# EasyEDA Pro project ProProject_MagicBerry_2.1.epro, board PCB_2.1
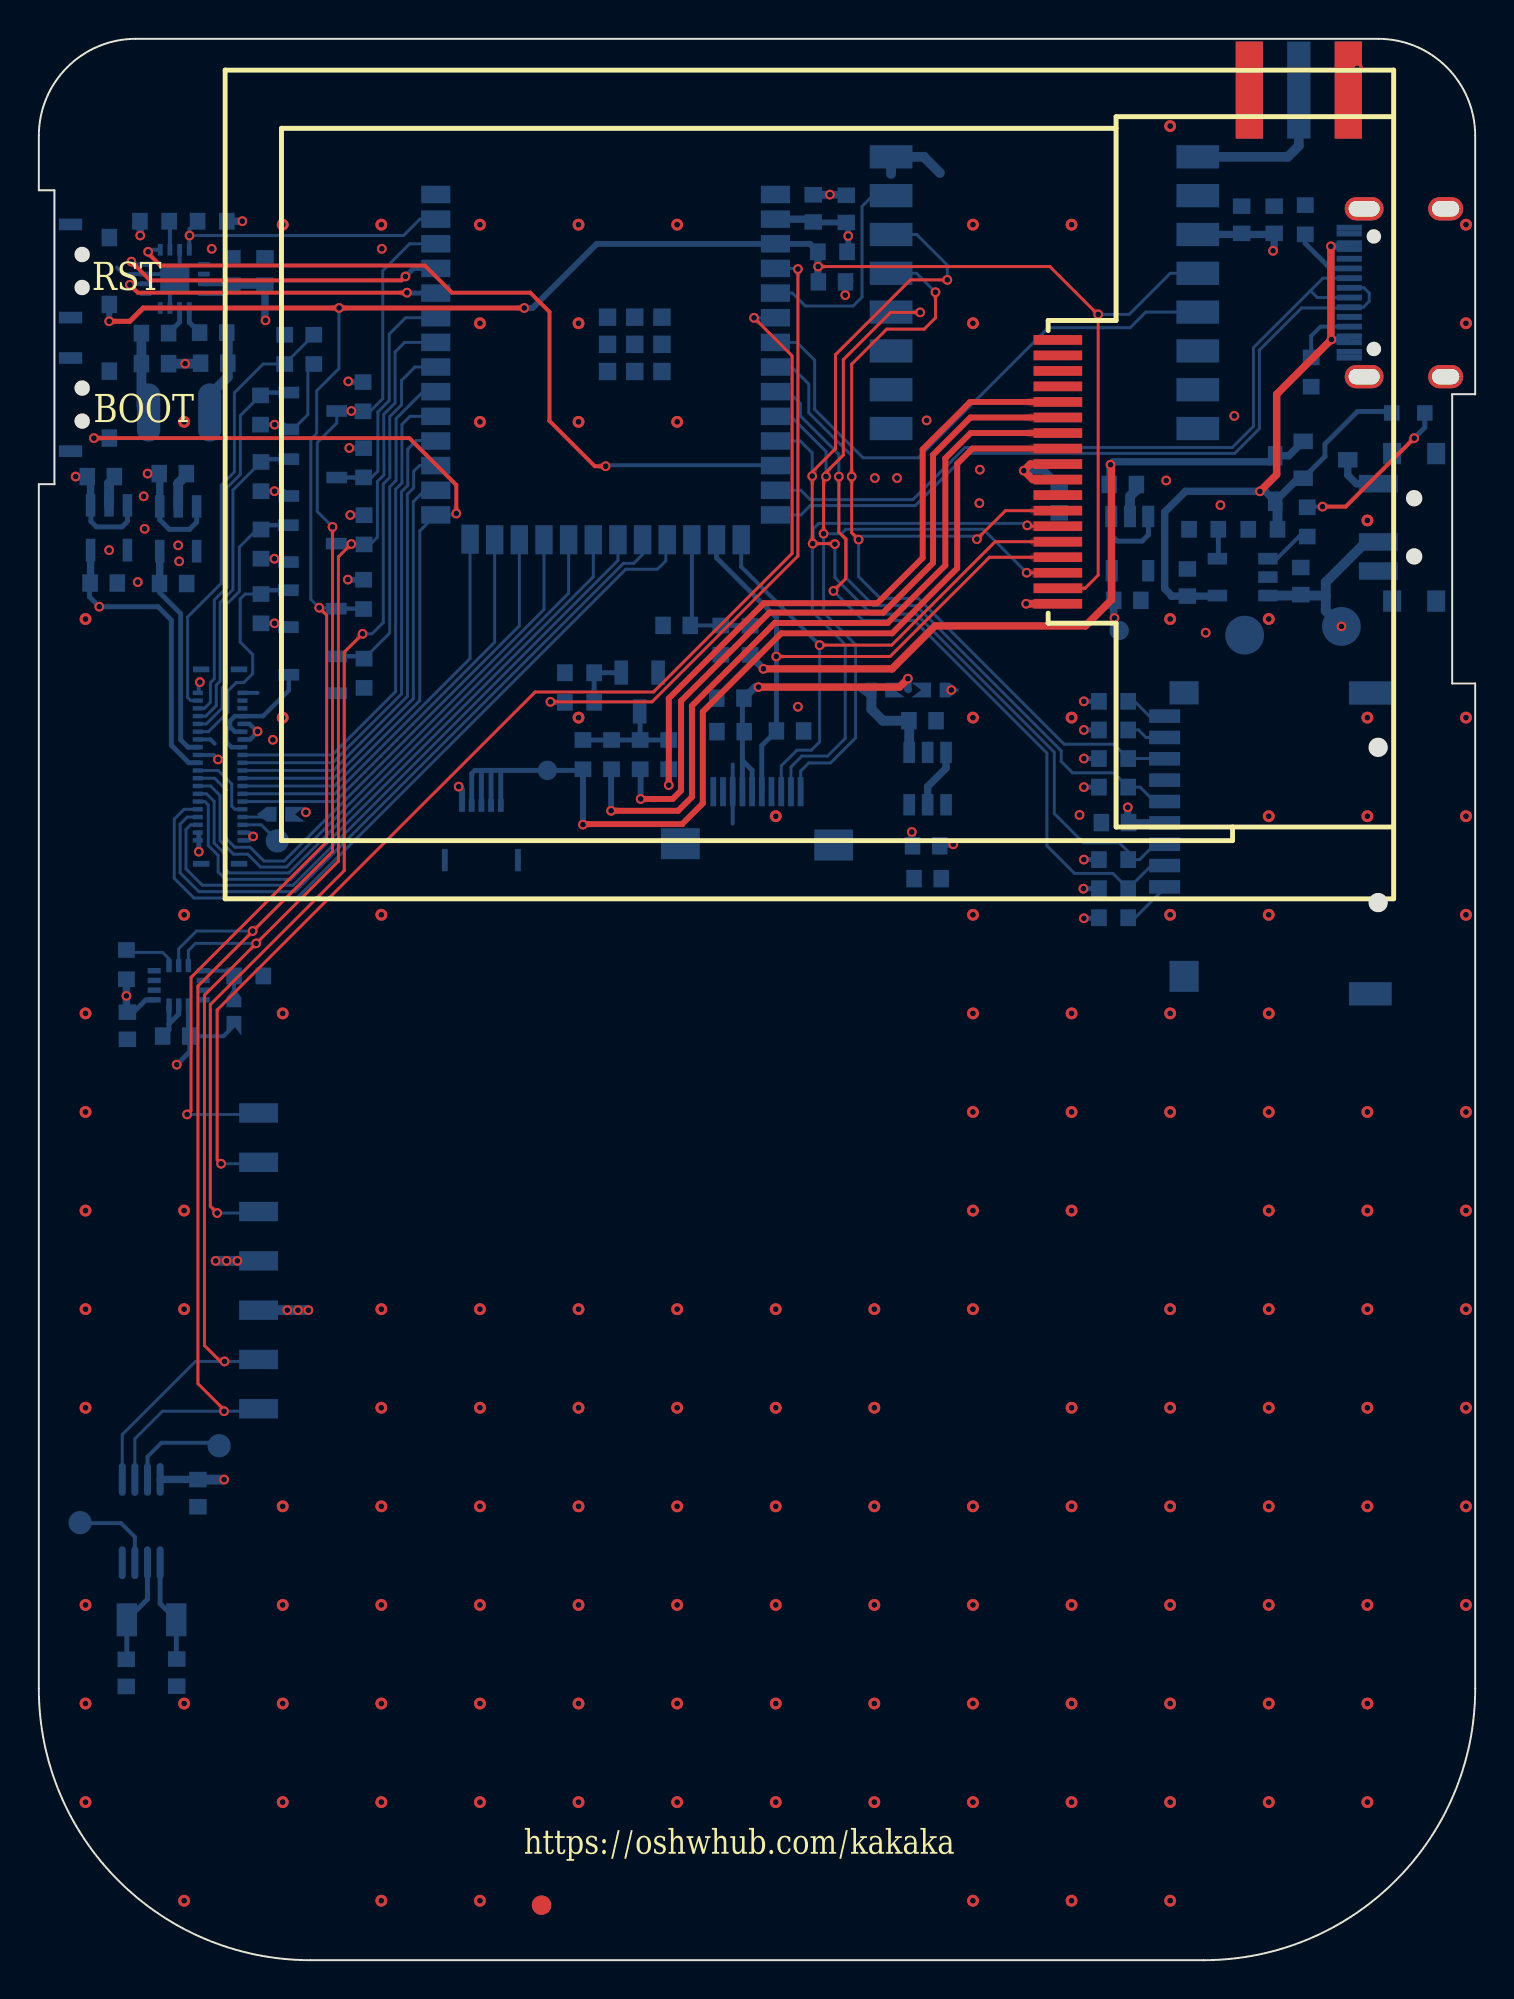
[diagram p9: board, top side]
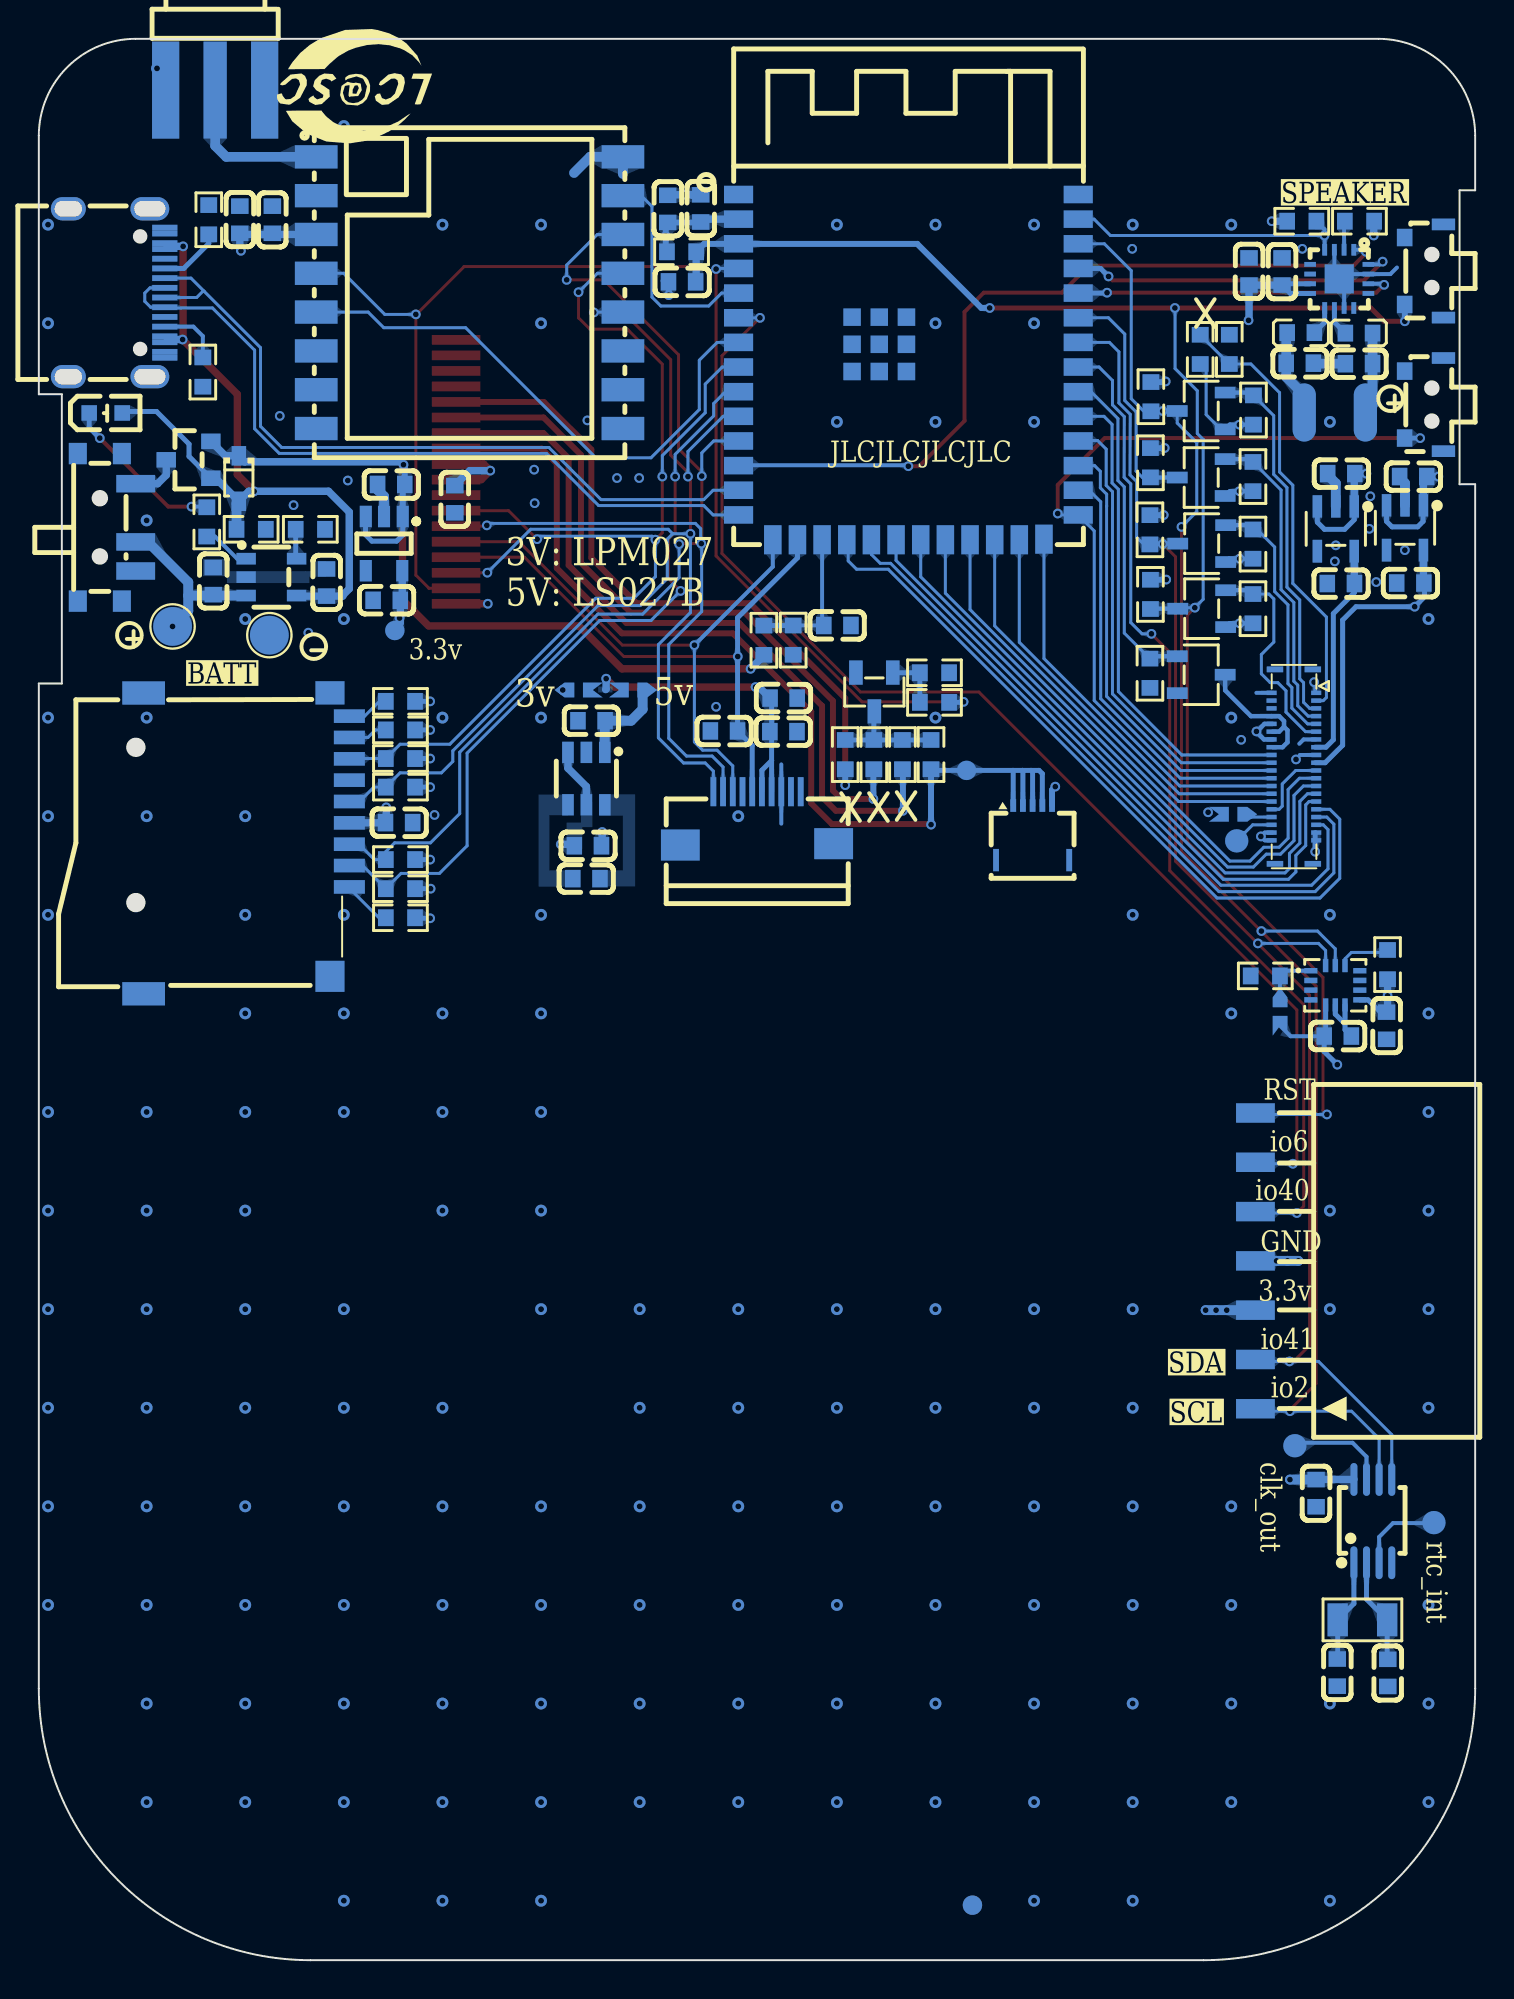
[diagram p10: board, bottom side, seen from below]

Outline 74 x 99 mm; copper layers: Top Layer, PWR, GND, Bottom Layer. Coordinates in mm from the lower left corner of the outline.
Outline path: 0,94 0,91.19 0.81,91.19 0.81,76.05 0,76.05 0,14 arc(4.1,4.1) 14,0 60,0 arc(69.9,4.1) 74,14 74,65.78 72.81,65.78 72.81,80.69 74,80.69 74,94 arc(72.54,97.54) 69,99 5,99 arc(1.46,97.54) 0,94
Stack: Top Layer 0.035mm / Dielectric1 0.48mm PP er 4.5 / PWR 0.035mm / Dielectric2 0.48mm FR4 er 4.5 / GND 0.035mm / Dielectric3 0.48mm PP er 4.5 / Bottom Layer 0.035mm

## Design rules (mm)
net IO20: DP1
net IO19: DP1
template: 用户自定义配置
spacing safeClearance (default): track to track 0.15, other pairs 0.152 to 0.3
track width trackWidth (default): min 0.127, default 0.254, max 2.54
differential pair differentialPair (default): width min 0.127, default 0.254, max 2.54; gap min 0.152, default 0.152
via viaSize (default): diameter min 0.5, default 0.61, max 10; hole min 0.3, default 0.305, max 5.999
net 3.3V uses copperRegion1

## Placement (name value [footprint] x y rotation side)
C2  10uF  [C0603]  55.85 76.04 0 bottom
C5  10uF  [C0603]  56.08 70.07 180 bottom
C8  1uF  [C0603]  3.19 76.44 0 bottom
C10  10uF  [C0603]  65.02 71.06 270 bottom
C11  10uF  [C0603]  59.17 70.98 270 bottom
C16  100nF  [C0603]  38.7 63.34 0 bottom
C17  1uF  [C0603]  35.64 63.3 180 bottom
C18  100nF  [C0603]  35.63 65.03 180 bottom
C27  100nF  [C0603]  55.44 58.61 0 bottom
C31  10uF  [C0603]  41.6 90.24 270 bottom
C32  100nF  [C0603]  39.9 90.26 90 bottom
C33  1uF  [C0603]  40.86 86.48 0 bottom
C34  10uF  [C0603]  11.65 87.01 270 bottom
C35  100nF  [C0603]  9.95 87.01 90 bottom
C36  10uF  [C0603]  45.71 57.42 0 bottom
C37  10uF  [C0603]  45.52 63.86 180 bottom
C38  2.2uF  [C0603]  45.79 55.73 180 bottom
C39  1uF  [C0603]  6.92 70.93 0 bottom
C40  1uF  [C0603]  3.34 70.96 0 bottom
C41  1uF  [C0603]  6.9 76.6 0 bottom
C42  100nF  [C0603]  32.86 68.77 180 bottom
C43  10uF  [C0603]  52.57 75.28 90 bottom
C44  10uF  [C0603]  63.64 89.68 270 bottom
C45  100nF  [C0603]  61.97 89.68 90 bottom
C47  680pF  [C0603]  9.03 82.29 0 bottom
C48  680pF  [C0603]  5.99 82.26 0 bottom
C49  6pF  [C0603]  4.5 14.8 90 bottom
C50  6pF  [C0603]  7.1 14.82 270 bottom
C51  10uF  [C0603]  8.2 24.06 90 bottom
C52  100nF  [C0603]  7.08 47.62 180 bottom
C53  100nF  [C0603]  4.56 48.15 270 bottom
CARD1  TF-01A  [TF-SMD_TF-02]  63.3 57.55 270 bottom
D4  1N5819WS  [SOD-323_L1.8-W1.3-LS2.5-RD]  63.7 76.34 270 bottom
FPC1  AFC01-S10FCC-00  [FPC-SMD_AFC01-S10FCC-00]  37 58.83 180 bottom
FPC2  0.5K-QX-5PWB  [FPC-SMD_5P-P0.50_HDGC_0.5K-QX-5PWB]  22.8 58.09 180 bottom
J1  2短路点  [短路接口]  12.57 59.05 0 bottom
J2  2短路点  [短路接口]  43.48 65.45 0 bottom
J3  2短路点  [短路接口]  46.09 65.45 180 bottom
J4  2短路点  [短路接口]  10.05 48.78 270 bottom
L3  BLM18SG331TN1D  [L0603]  5.99 83.84 180 bottom
L4  BLM18SG331TN1D  [L0603]  8.98 83.86 0 bottom
LED5  -  [LED0603-R-RD]  70.55 79.72 180 bottom
NOREF  -  [Pad_e339]  5.66 79.75 0 top
NOREF#2  -  [Pad_e323]  9.29 26.51 0 top
NOREF#3  -  [Pad_e2492]  25.9 2.84 0 top
NOREF#4  -  [Pad_e348]  2.13 22.55 0 top
NOREF#5  -  [Pad_e340]  8.81 79.75 0 top
NOREF#6  -  [Pad_e2940]  12.29 57.67 0 top
NOREF#7  -  [Pad_e2494]  25.9 2.84 0 top
P1  HDR-PAD_2.54  [PAD1_SMD_1.2]  55.66 68.51 180 bottom
P2  HDR-PAD_2.54  [PAD1_SMD_1.2]  26.2 61.31 0 bottom
Q1  BSS138  [SOT-23-3_L2.9-W1.6-P1.90-LS2.8-BR]  14.11 66.23 0 bottom
Q3  BSS138  [SOT-23-3_L2.9-W1.6-P1.90-LS2.8-BR]  14.11 79.82 180 bottom
Q4  BSS138  [SOT-23-3_L2.9-W1.6-P1.90-LS2.8-BR]  14.09 72.99 180 bottom
Q5  BSS138  [SOT-23-3_L2.9-W1.6-P1.90-LS2.8-BR]  14.11 76.39 180 bottom
Q6  BSS138  [SOT-23-3_L2.9-W1.6-P1.90-LS2.8-BR]  14.09 69.64 180 bottom
Q7  AO3401A  [SOT-23_L2.9-W1.3-P1.90-LS2.4-BR]  66.29 77.31 180 bottom
Q10  -  [SOT-23-3_L2.9-W1.3-P1.90-LS2.4-BR]  30.95 65.34 90 bottom
R1  10kΩ  [R0603]  16.76 66.31 90 bottom
R3  5.1kΩ  [R0603]  65.24 89.68 90 bottom
R6  5.1kΩ  [R0603]  65.55 81.83 270 bottom
R10  10kΩ  [R0603]  14.17 83 270 bottom
R12  10kΩ  [R0603]  11.42 79.87 270 bottom
R13  10kΩ  [R0603]  16.71 80.56 90 bottom
R14  10kΩ  [R0603]  11.45 72.97 270 bottom
R15  10kΩ  [R0603]  16.76 73.7 90 bottom
R16  10kΩ  [R0603]  11.45 76.44 270 bottom
R17  10kΩ  [R0603]  16.73 77.16 90 bottom
R18  10kΩ  [R0603]  11.45 69.64 270 bottom
R19  10kΩ  [R0603]  16.73 70.37 90 bottom
R28  10kΩ  [R0603]  55.37 55.21 180 bottom
R29  10kΩ  [R0603]  55.37 56.71 180 bottom
R30  10kΩ  [R0603]  55.37 60.44 180 bottom
R31  10kΩ  [R0603]  55.37 61.92 180 bottom
R32  10kΩ  [R0603]  55.37 64.86 180 bottom
R33  10kΩ  [R0603]  40.89 88.03 0 bottom
R34  10kΩ  [R0603]  55.37 53.71 180 bottom
R35  10kΩ  [R0603]  55.37 63.39 180 bottom
R36  100kΩ  [R0603]  63.06 73.73 0 bottom
R39  1kΩ  [R0603]  65.35 74.11 90 bottom
R41  1.65kΩ  [R0603]  60.01 73.73 0 bottom
R42  634kΩ  [R0603]  8.93 89.6 0 bottom
R43  100kΩ  [R0603]  5.96 89.6 180 bottom
R44  10kΩ  [R0603]  27.86 66.34 0 bottom
R45  1kΩ  [R0603]  27.86 64.81 0 bottom
R46  20Ω  [R0603]  28.03 62.12 270 bottom
R47  20Ω  [R0603]  29.51 62.12 270 bottom
R48  20Ω  [R0603]  30.98 62.12 270 bottom
R49  20Ω  [R0603]  32.45 62.12 270 bottom
R50  100kΩ  [R0603]  35.13 68.02 90 bottom
R51  200kΩ  [R0603]  36.64 68.01 270 bottom
R53  10kΩ  [R0603]  12.67 83 270 bottom
R54  10kΩ  [R0603]  4.51 51.3 270 bottom
R55  10kΩ  [R0603]  10.81 50.71 0 bottom
RF1  KH-SMA-KE8-G  [CONN-SMD_KH-SMA-KE8-G]  64.91 96.36 180 bottom
SW8  TD-1100SA-250  [SW-SMD_TD-1100SA-250]  2.63 80.15 270 bottom
SW9  TD-1100SA-250  [SW-SMD_TD-1100SA-250]  2.63 87.04 270 bottom
SW11  MK-12C02-G020  [SW-SMD_MK-12C02-G020]  70.5 73.83 270 bottom
TP3  TestPoint  [TestPoint:TestPoint_Pad_D1.0mm]  67.11 68.72 0 bottom
TP4  TestPoint  [TestPoint:TestPoint_Pad_D1.0mm]  62.12 68.27 0 bottom
U1  BBQ20KBD  [Connector_Hirose_Extra:BM20B(0.8)-40DS-0.4V]  9.34 61.5 270 bottom
U3  X6511FRS-07-C85D30  [HDR-SMD_7P-P2.54-H-F-L11.5]  11.32 36.03 90 bottom
U4  ME6212C18M5G  [SOT-23-5_L3.0-W1.7-P0.95-LS2.8-BL]  3.62 73.81 0 bottom
U5  ME6212C28M5G  [SOT-23-5_L3.0-W1.7-P0.95-LS2.8-BL]  7.18 73.75 0 bottom
U6  AP2112K-3.3TRG1  [SOT-25-5_L3.0-W1.8-P0.95-LS3.0-BR]  56.2 72.99 90 bottom
U14  ESP32-S3-WROOM-1-N8R2  [WIRELM-SMD_ESP32-S3-WROOM-1]  29.2 82.08 180 bottom
U15  MAX98357AETE+T  [TQFN-16_L3.0-W3.0-P0.50-BL-EP1.5]  7 86.63 0 bottom
U16  Ra-01S  [COMM-SMD_RA-01S]  51.81 85.92 180 bottom
U18  -  [SOT-23-5_L3.0-W1.7-P0.95-LS2.8-BR]  62.02 71.26 0 bottom
U19  ILI9341_2.4寸_SPI_18PIN  [ILI9341_2.4寸_240X320_SPI_18PIN]  37 76.04 90 top
U20  HX4002-MFC  [SOT-23-6_L2.9-W1.6-P0.95-LS2.8-BR]  45.79 60.88 90 bottom
U25  BM8563EMA  [MSOP-8_L3.0-W3.0-P0.65-LS5.0-BL]  5.27 22.62 180 bottom
U26  LSM6DS3TR-C  [LGA-14_L3.0-W2.5-P0.50-TL]  7.21 50.23 180 bottom
USBC1  TYPE-C-31-M-12  [USB-C_SMD-TYPE-C-31-M-12]  69.99 85.92 270 bottom
X3  32.768kHz  [OSC-SMD_L3.2-W1.5]  5.81 17.54 0 bottom

## Footprints (pads in the part's own frame, mm; a bottom-side part is the same pattern mirrored in y, then rotated)
C0603
  rect 0.8x0.9 smd: 1(-0.7,0) 2(0.7,0)
COMM-SMD_RA-01S
  rect 2.2x1.2 smd: 1(-7.9,7) 2(-7.9,5) 3(-7.9,3) 4(-7.9,1) 5(-7.9,-1) 6(-7.9,-3) 7(-7.9,-5) 8(-7.9,-7) 9(7.9,-7) 10(7.9,-5) 11(7.9,-3) 12(7.9,-1) 13(7.9,1) 14(7.9,3) 15(7.9,5) 16(7.9,7)
CONN-SMD_KH-SMA-KE8-G
  rect 1.4x5 smd: 1(-2.55,0) 2(2.55,0)
  rect 1.4x5 smd far side: 3(-2.55,0) 4(2.55,0)
  rect 1.2x5 smd: 5(0,0)
Connector_Hirose_Extra:BM20B(0.8)-40DS-0.4V
  rect 0.23x0.52 smd: 1(-3.8,1.15) 2(-3.4,1.15) 3(-3,1.15) 4(-2.6,1.15) 5(-2.2,1.15) 6(-1.8,1.15) 7(-1.4,1.15) 8(-1,1.15) 9(-0.6,1.15) 10(-0.2,1.15) 11(0.2,1.15) 12(0.6,1.15) 13(1,1.15) 14(1.4,1.15) 15(1.8,1.15) 16(2.2,1.15) 17(2.6,1.15) 18(3,1.15) 19(3.4,1.15) 20(3.8,1.15) 21(3.8,-1.15) 22(3.4,-1.15) 23(3,-1.15) 24(2.6,-1.15) 25(2.2,-1.15) 26(1.8,-1.15) 27(1.4,-1.15) 28(1,-1.15) 29(0.6,-1.15) 30(0.2,-1.15) 31(-0.2,-1.15) 32(-0.6,-1.15) 33(-1,-1.15) 34(-1.4,-1.15) 35(-1.8,-1.15) 36(-2.2,-1.15) 37(-2.6,-1.15) 38(-3,-1.15) 39(-3.4,-1.15) 40(-3.8,-1.15)
  rect 0.3x0.85 smd: 41(-5.01,0.975) 42(-5.01,-0.975) 43(5.01,0.975) 44(5.01,-0.975)
FPC-SMD_5P-P0.50_HDGC_0.5K-QX-5PWB
  rect 0.3x0.65 smd: 1(-1,1.405) 2(-0.5,1.405) 3(0,1.405) 4(0.5,1.405) 5(1,1.405)
  rect 0.3x1.15 smd: 6(1.885,-1.405) 7(-1.885,-1.405)
FPC-SMD_AFC01-S10FCC-00
  rect 0.3x1.5 smd: 1(-2.248,1.373) 2(-1.748,1.373) 3(-1.248,1.373) 4(-0.748,1.373) 5(-0.247,1.373) 6(0.253,1.373) 7(0.753,1.373) 8(1.252,1.373) 9(1.752,1.373) 10(2.252,1.373)
  rect 2x1.6 smd: 11(-3.95,-1.373) 12(3.95,-1.305)
HDR-SMD_7P-P2.54-H-F-L11.5
  rect 1x2 smd: 1(-7.62,0) 2(-5.08,0) 3(-2.54,0) 4(0,0) 5(2.54,0) 6(5.08,0) 7(7.62,0)
ILI9341_2.4寸_240X320_SPI_18PIN
  rect 0.5x2.5 smd: 1(-6.15,-15.5) 2(-5.35,-15.5) 3(-4.55,-15.5) 4(-3.75,-15.5) 5(-2.95,-15.5) 6(-2.15,-15.5) 7(-1.35,-15.5) 8(-0.55,-15.5) 9(0.25,-15.5) 10(1.05,-15.5) 11(1.85,-15.5) 12(2.65,-15.5) 13(3.45,-15.5) 14(4.25,-15.5) 15(5.05,-15.5) 16(5.85,-15.5) 17(6.65,-15.5) 18(7.45,-15.5)
L0603
  rect 0.8x0.864 smd: 1(-0.7,0) 2(0.7,0)
LED0603-R-RD
  rect 0.8x0.8 smd: 1(0.851,0) 2(-0.851,0)
LGA-14_L3.0-W2.5-P0.50-TL
  rect 0.675x0.28 smd: 1(-1.262,0.75) 2(-1.262,0.25) 3(-1.262,-0.25) 4(-1.262,-0.75) 8(1.262,-0.75) 9(1.262,-0.25) 10(1.262,0.25) 11(1.262,0.75)
  rect 0.28x0.675 smd: 5(-0.5,-1.012) 6(0,-1.012) 7(0.5,-1.012) 12(0.5,1.012) 13(0,1.012) 14(-0.5,1.012)
MSOP-8_L3.0-W3.0-P0.65-LS5.0-BL
  oval 0.364x1.692 smd: 1(-0.975,-2.146) 2(-0.325,-2.146) 3(0.325,-2.146) 4(0.975,-2.146) 5(0.975,2.146) 6(0.325,2.146) 7(-0.325,2.146) 8(-0.975,2.146)
OSC-SMD_L3.2-W1.5
  rect 1.05x1.7 smd: 1(-1.275,0) 2(1.275,0)
PAD1_SMD_1.2
  round 1 smd: 1(0,0)
Pad_e323
  round 1.2 smd far side: 1(0,0)
Pad_e339
  oval 1.2x3 smd far side: 1(0,0)
Pad_e340
  oval 1.2x3 smd far side: 2(0,0)
Pad_e348
  round 1.2 smd far side: 1(0,0)
Pad_e2492
  round 1 smd: 1(0,0)
Pad_e2494
  round 1 smd far side: 1(0,0)
Pad_e2940
  round 1.2 smd far side: 1(0,0)
R0603
  rect 0.806x0.864 smd: 1(-0.753,0) 2(0.753,0)
SOD-323_L1.8-W1.3-LS2.5-RD
  rect 1x0.75 smd: 1(-1.173,0) 2(1.173,0)
SOT-23-3_L2.9-W1.3-P1.90-LS2.4-BR
  rect 1.25x0.7 smd: 1(1,-0.95) 2(1,0.95) 3(-1,0)
SOT-23-3_L2.9-W1.6-P1.90-LS2.8-BR
  rect 1.07x0.6 smd: 1(1.235,-0.95) 2(1.235,0.95) 3(-1.235,0)
SOT-23-5_L3.0-W1.7-P0.95-LS2.8-BL
  rect 0.49x1.157 smd: 1(-0.95,-1.153) 2(0,-1.153) 3(0.95,-1.153)
  rect 0.49x1.175 smd: 4(0.95,1.153) 5(-0.95,1.153)
SOT-23-5_L3.0-W1.7-P0.95-LS2.8-BR
  rect 1.001x0.6 smd: 1(1.3,-0.95) 2(1.3,0) 3(1.3,0.95) 4(-1.3,0.95) 5(-1.3,-0.95)
SOT-23-6_L2.9-W1.6-P0.95-LS2.8-BR
  rect 1.1x0.6 smd: 1(1.35,-0.95) 2(1.35,0) 3(1.35,0.95) 4(-1.35,0.95) 5(-1.35,0) 6(-1.35,-0.95)
SOT-23_L2.9-W1.3-P1.90-LS2.4-BR
  rect 1x0.8 smd: 1(1.15,-0.95) 2(1.15,0.95) 3(-1.15,0)
SOT-25-5_L3.0-W1.8-P0.95-LS3.0-BR
  rect 1.105x0.623 smd: 1(1.397,-0.953) 2(1.397,0.013) 3(1.397,0.953) 4(-1.397,0.953) 5(-1.397,-0.927)
SW-SMD_MK-12C02-G020
  rect 0.9x2 smd: 1(-2.25,1.49) 2(0.75,1.49) 3(2.25,1.49)
  rect 1.1x0.93 smd: 4(3.8,0.779) 5(3.8,-1.49) 6(-3.8,-1.49) 7(-3.8,0.779)
SW-SMD_TD-1100SA-250
  rect 0.9x0.8 smd: 1(-1.725,-1) 2(1.725,-1)
  rect 0.6x1.2 smd: 3(-2.4,1) 4(2.4,1)
TestPoint:TestPoint_Pad_D1.0mm
  round 2 smd: 1(0,0)
TF-SMD_TF-02
  rect 0.7x1.6 smd: 1(2.245,5.3) 2(1.145,5.3) 3(0.046,5.3) 4(-1.054,5.3) 5(-2.155,5.3) 6(-3.255,5.3) 7(-4.354,5.3) 8(-5.454,5.3) 9(-6.554,5.3)
  rect 1.2x1.5 smd: 10(-7.754,4.3)
  rect 1.2x2.2 smd: 11(-7.746,-5.3) 12(7.754,-5.3)
  rect 1.6x1.5 smd: 13(6.854,4.3)
TQFN-16_L3.0-W3.0-P0.50-BL-EP1.5
  rect 0.25x0.6 smd: 1(-0.749,-1.5) 2(-0.248,-1.5) 3(0.252,-1.5) 4(0.751,-1.5) 9(0.75,1.5) 10(0.25,1.5) 11(-0.25,1.5) 12(-0.749,1.5)
  rect 0.6x0.25 smd: 5(1.5,-0.748) 6(1.5,-0.248) 7(1.5,0.252) 8(1.5,0.752) 13(-1.5,0.752) 14(-1.5,0.252) 15(-1.5,-0.248) 16(-1.5,-0.748)
  rect 1.5x1.5 smd: 17(0,0)
USB-C_SMD-TYPE-C-31-M-12
  oval 1.2x2 hole 0.8x1.6: 0(-4.325,1.716) 1(4.325,1.716)
  oval 1.2x1.8 hole 0.8x1.4: 2(4.325,-2.484) 3(-4.325,-2.484)
  rect 0.3x1.3 smd: A1(-3.35,2.484) A4(-2.55,2.484) A5(-1.25,2.484) A6(-0.25,2.484) A7(0.25,2.484) A8(1.25,2.484) A9(2.55,2.484) A12(3.35,2.484) B1(3.05,2.484) B4(2.25,2.484) B5(1.75,2.484) B6(0.75,2.484) B7(-0.75,2.484) B8(-1.75,2.484) B9(-2.25,2.484) B12(-3.05,2.484)
WIRELM-SMD_ESP32-S3-WROOM-1
  rect 1.5x0.9 smd: 1(-8.75,8.895) 2(-8.75,7.625) 3(-8.75,6.355) 4(-8.75,5.085) 5(-8.75,3.815) 6(-8.75,2.545) 7(-8.75,1.275) 8(-8.75,0.005) 9(-8.75,-1.265) 10(-8.75,-2.535) 11(-8.75,-3.805) 12(-8.75,-5.075) 13(-8.75,-6.345) 14(-8.75,-7.615) 27(8.75,-7.615) 28(8.75,-6.345) 29(8.75,-5.075) 30(8.75,-3.805) 31(8.75,-2.535) 32(8.75,-1.265) 33(8.75,0.005) 34(8.75,1.275) 35(8.75,2.545) 36(8.75,3.815) 37(8.75,5.085) 38(8.75,6.355) 39(8.75,7.625) 40(8.75,8.895)
  rect 0.9x1.5 smd: 15(-6.985,-8.895) 16(-5.715,-8.895) 17(-4.445,-8.895) 18(-3.175,-8.895) 19(-1.905,-8.895) 20(-0.635,-8.895) 21(0.635,-8.895) 22(1.905,-8.895) 23(3.175,-8.895) 24(4.445,-8.895) 25(5.715,-8.895) 26(6.985,-8.865)
  rect 0.9x0.9 smd: 41(-2.9,-0.225) 41(-2.9,1.175) 41(-2.9,2.575) 41(-1.5,-0.225) 41(-1.5,1.175) 41(-1.5,2.575) 41(-0.1,-0.225) 41(-0.1,1.175) 41(-0.1,2.575)
短路接口
  custom 1.016x0.762 smd: 1(-0.572,0) 2(0.635,0)

## Nets
As in the schematic, except:
CLK_OUT: NOREF#2.1 U25.7
LORA_MISO: CARD1.7 R31.1 U14.8 U16.13 U19.7
LORA_MOSI: CARD1.3 FPC1.2 R29.1 U14.11 U16.14 U19.6
LORA_SCK: CARD1.5 FPC1.1 R30.1 U14.10 U16.12 U19.3
MIC: NOREF#6.1 U1.23
RTC_INT: NOREF#4.1 U25.3
VON: C48.1 L3.2 NOREF.1
VOP: C47.2 L4.2 NOREF#5.2

Pads without a net: NOREF#3 1; NOREF#7 1; SW8 3 4; SW9 3 4; SW11 3 4 5 6 7; U1 38 39 41 42 43 44; U4 4; U5 4; U6 4; U15 5 6 12 13; U16 6 7 8 10 11; U19 15 16 17 18; U26 2 3 4 9 10 11; USBC1 A8 B8

## Via types
v1: diameter 0.5, hole 0.3, Top Layer to Bottom Layer, 129 vias
v2: diameter 0.61, hole 0.305, Top Layer to Bottom Layer, 143 vias

## Routing (per net, layer and track width the routed paths; a pad name or vN(x,y) marks a point on that pad's centre or on a via; arc(x,y) is an arc through that point)
1.8V: length 44.7
  PWR w0.508: v1(12.14,68.88) 12.13,68.9 12.13,69.77 ; 12.13,69.77 12.09,69.74 v1(3.12,69.74) ; 12.13,69.77 12.13,79.1 v1(12.15,79.12)
  Bottom Layer w0.152: R10.2 13.86,81.94 13.86,79.64 13.1,78.87 Q3.1
  Bottom Layer w0.229: Q6.1 12.66,68.88 v1(12.14,68.88) R18.2 ; R12.2 v1(12.15,79.12) 12.63,79.12 Q3.1 ; Q5.1 12.63,75.69 v1(12.14,75.69) R16.2 ; R14.2 v1(12.14,72.21) 12.68,72.21 12.85,72.04
  Bottom Layer w0.254: 8.24,61.7 7.73,61.7 6.83,62.6 6.83,69.05 6.14,69.74 v1(3.12,69.74) 2.61,70.25 2.61,70.92 C40.1 2.67,70.98
  Bottom Layer w0.381: U4.5 2.67,70.98
2.8V: length 11.3
  Bottom Layer w0.254: 8.24,62.5 7.69,62.5 7.31,62.88 7.31,69.38 6.22,70.47 C39.1 6.23,70.95
  Bottom Layer w0.381: U5.5 6.23,70.95
3.3V: length 69.6
  Top Layer w0.381: U19.9 51.2,76.29 v1(50.74,76.75) 51.08,77.09 U19.10
  Bottom Layer w0.203: 9.75,86.38 9.88,86.38 C35.1 ; 7.78,47.48 7.91,47.61 9.51,47.61 J4.2
  Bottom Layer w0.229: 10.42,62.9 10.88,62.9 11.27,63.29 10.86,63.7 10.42,63.7
  Bottom Layer w0.254: v1(53.84,63.39) R35.2 ; v1(53.84,64.86) R32.2 ; v1(53.84,53.69) 54.59,53.69 R34.2 ; v1(53.84,60.44) R30.2 ; U26.8 5.52,49.48 4.88,48.85 C53.1 ; U15.8 9.52,85.88 C35.1 ; v1(53.81,55.21) R28.2 ; v1(7.1,46.14) 7.78,46.82 C52.1 7.71,47.69 U26.5 ; U5.3 8.13,74.09 7.76,73.73 6.72,73.73 6.23,74.22 U5.1 ; 2.67,75.11 U4.1 2.68,74.94 2.68,74.13 2.96,73.85 4.28,73.85 4.57,74.14 U4.3 ; U15.7 9.75,86.38 ; v1(53.84,61.92) R31.2 ; v1(53.84,56.71) R29.2
  Bottom Layer w0.305: 39.98,89.54 41.7,89.54 v1(41.7,88.84) 41.7,88.09 R33.2 ; R13.2 15.98,81.31 v1(15.94,81.35) ; FPC2.5 21.8,60.3 v1(21.63,60.47) ; R19.2 15.93,71.13 v1(15.92,71.14) ; v1(15.99,77.92) 16,77.91 R17.2 ; R15.2 16.05,74.45 v1(16.05,74.46)
  Bottom Layer w0.381: v1(11.68,84.5) 11.65,84.52 C34.2 C35.1 ; 46.49,57.4 46.49,57.5 v1(47.11,57.5) ; CARD1.4 56.47,58.6 56.1,58.97 v1(56.1,59.4) ; 2.67,75.11 2.67,76.34 2.56,76.44 ; 4.51,50.42 v1(4.51,49.69) 4.51,48.9 C53.1 ; v1(5.61,76.6) 6.18,76.6 6.23,76.55 ; v1(5.22,88.87) 5.22,89.59 5.21,89.6 ; U20.3 46.74,61.42 45.79,60.47 U20.5 ; v1(50.74,76.75) 51.8,76.75 C43.2 ; v1(1.9,76.44) 2.41,76.44 ; 39.97,89.55 39.81,89.71 U14.2 ; 6.23,76.55 U5.1 ; 6.23,76.55 6.28,76.6 ; U16.3 63.59,88.92 C44.2 63.64,88.14 v1(63.59,88.08) ; 55.75,68.55 55.38,68.92 55.38,70.07 55.28,70.17 U6.5 ; R42.2 v1(10.48,89.6)
  Bottom Layer w0.508: 10.89,33.49 v1(12.8,33.49) v1(13.35,33.49) v1(13.89,33.49)
  vias: v1(11.27,63.31) v1(13.76,59.15) v1(47.01,65.45) v1(55.42,69.16)
+5V: length 38.8
  Top Layer w0.381: v1(66.57,88.31) 66.57,83.53 v1(66.59,83.51) 63.77,80.69 63.77,76.55 v1(62.91,75.68)
  Bottom Layer w0.254: LED5.1 69.63,79.8 67.94,79.8 66.26,78.12 66.26,77.48 Q7.1
  Bottom Layer w0.381: U18.4 60.69,70.28 C11.2 ; C11.2 59.16,70.27 ; C11.2 58.39,70.28 ; 58.39,70.28 58.01,70.66 58.01,74.62 59.08,75.69 63.18,75.69 D4.2 64.88,76.36 Q7.1 ; 58.39,70.28 58.34,70.28 ; v1(66.57,88.31) 67.37,88.31 ; v1(66.59,83.51) 67.37,83.51
  Bottom Layer w0.508: D4.2 63.81,75.05 R36.2
GND: length 40.9
  Top Layer w0.381: 52.5,69.89 50.87,69.89 v1(50.87,69.89)
  Bottom Layer w0.152: 10.42,59.3 10.1,59.3 9.94,59.46 9.94,60.61 9.24,61.3 8.24,61.3
  Bottom Layer w0.203: 10.42,58.1 10.84,58.1 v1(11.04,57.9) 10.84,57.7 10.42,57.7 ; U15.17 6.75,86.38 U15.11 ; U15.17 6.76,86.88 U15.15 4.37,86.88 4.03,87.21 ; U15.17 7.25,86.88 U15.3 ; 8.24,62.1 9.03,62.1 ; 10.42,65.3 11.27,65.3 ; 35.75,58.56 FPC1.8 35.75,61.61 ; 8.24,62.9 8.84,62.9 9.06,62.68 ; v1(8.3,65.85) 8.24,65.79 8.24,65.3
  Bottom Layer w0.254: U26.7 6.71,48.24 ; 6.71,48.24 7.21,48.75 U26.6 ; 6.71,48.24 6.71,47.94 C52.2 ; v1(8.24,57.12) 8.24,57.12 8.24,58.1
  Bottom Layer w0.305: 41.82,86.53 41.55,86.26 v1(41.55,85.79) ; 41.7,90.94 41.66,90.97 v1(40.76,90.97)
  Bottom Layer w0.381: v1(40.76,90.97) 40.34,90.97 40.33,90.96 ; 40.33,90.96 40.32,90.95 ; 40.33,90.96 C32.2 ; 40.33,90.96 41.57,90.96 C31.1 ; v1(44.98,58.13) 44.98,57.52 45.09,57.4
  Bottom Layer w0.508: U3.4 v1(10.23,36.03) v1(9.67,36.03) v1(9.11,36.03) ; 7.68,76.6 7.18,76.1 U5.2 ; C48.2 v1(7.54,82.26) 8.31,82.26 C47.1 ; 3.96,76.44 3.62,76.1 U4.2 ; C2.2 56.55,75.76 56.22,75.43 U6.2 ; 46.42,92.09 45.6,92.92 U16.16 43.91,92.04
  vias: v1(3.62,72.65) v1(5.1,71.01) v1(5.4,75.43) v1(5.45,73.75) v1(7.18,72.9) v1(7.23,72.08) v1(8.91,88.18) v1(9.23,61.87) v1(12.06,62.88) v1(17.67,88.18) v1(39.11,64.58) v1(43.07,76.37) v1(44.21,76.37) v1(45.74,79.34) v1(48.48,76.8) v1(48.46,75.07) v1(53.61,59.01) v1(58.08,76.24) v1(60.12,68.4) v1(60.88,74.97) v1(61.59,79.57) v2(2.41,69.1) v2(2.41,48.78) v2(2.41,43.7) v2(2.41,38.62) v2(2.41,33.54) v2(2.41,28.46) v2(2.41,18.3) v2(2.41,13.22) v2(2.41,8.14) v2(7.48,79.26) v2(7.48,53.86) v2(7.48,38.62) v2(7.48,33.54) v2(7.48,13.22) v2(7.48,3.06) v2(12.57,89.42) v2(12.57,64.02) v2(12.57,48.78) v2(12.57,23.38) v2(12.57,18.3) v2(12.57,13.22) v2(12.57,8.14) v2(17.64,89.42) v2(17.64,53.86) v2(17.64,33.54) v2(17.64,28.46) v2(17.64,23.38) v2(17.64,18.3) v2(17.64,13.22) v2(17.64,8.14) v2(17.64,3.06) v2(22.73,89.42) v2(22.73,84.34) v2(22.73,79.26) v2(22.73,33.54) v2(22.73,28.46) v2(22.73,23.38) v2(22.73,18.3) v2(22.73,13.22) v2(22.73,8.14) v2(22.73,3.06) v2(27.8,89.42) v2(27.8,84.34) v2(27.8,79.26) v2(27.8,64.02) v2(27.8,33.54) v2(27.8,28.46) v2(27.8,23.38) v2(27.8,18.3) v2(27.8,13.22) v2(27.8,8.14) v2(32.89,89.42) v2(32.89,79.26) v2(32.89,33.54) v2(32.89,28.46) v2(32.89,23.38) v2(32.89,18.3) v2(32.89,13.22) v2(32.89,8.14) v2(37.97,58.94) v2(37.97,33.54) v2(37.97,28.46) v2(37.97,23.38) v2(37.97,18.3) v2(37.97,13.22) v2(37.97,8.14) v2(43.05,33.54) v2(43.05,28.46) v2(43.05,23.38) v2(43.05,18.3) v2(43.05,13.22) v2(43.05,8.14) v2(48.13,89.42) v2(48.13,84.34) v2(48.13,64.02) v2(48.13,53.86) v2(48.13,48.78) v2(48.13,43.7) v2(48.13,38.62) v2(48.13,33.54) v2(48.13,23.38) v2(48.13,18.3) v2(48.13,13.22) v2(48.13,8.14) v2(48.13,3.06) v2(53.2,89.42) v2(53.2,64.02) v2(53.2,48.78) v2(53.2,43.7) v2(53.2,38.62) v2(53.2,28.46) v2(53.2,23.38) v2(53.2,18.3) v2(53.2,13.22) v2(53.2,8.14) v2(53.2,3.06) v2(58.29,94.5) v2(58.29,69.1) v2(58.29,53.86) v2(58.29,48.78) v2(58.29,43.7) v2(58.29,33.54) v2(58.29,28.46) v2(58.29,23.38) v2(58.29,18.3) v2(58.29,13.22) v2(58.29,8.14) v2(58.29,3.06) v2(63.36,69.1) v2(63.36,58.94) v2(63.36,53.86) v2(63.36,48.78) v2(63.36,43.7) v2(63.36,38.62) v2(63.36,33.54) v2(63.36,28.46) v2(63.36,23.38) v2(63.36,18.3) v2(63.36,13.22) v2(63.36,8.14) v2(67.91,97.48) v2(68.45,74.18) v2(68.45,64.02) v2(68.45,58.94) v2(68.45,43.7) v2(68.45,38.62) v2(68.45,33.54) v2(68.45,28.46) v2(68.45,23.38) v2(68.45,18.3) v2(68.45,13.22) v2(68.45,8.14) v2(73.53,89.42) v2(73.53,84.34) v2(73.53,64.02) v2(73.53,58.94) v2(73.53,53.86) v2(73.53,43.7) v2(73.53,38.62) v2(73.53,33.54) v2(73.53,28.46) v2(73.53,23.38) v2(73.53,18.3)
VBAT: length 100.8
  PWR w0.508: v1(9.54,24.76) 43.59,24.76 59.3,40.48 59.3,60.91 v1(67.11,68.72)
  Bottom Layer w0.381: C51.2 8.19,24.77 U25.8
  Bottom Layer w0.508: 66.3,70.31 66.3,71 68.41,73.1 69.6,73.1 ; 66.3,70.31 66.3,69.53 v1(67.11,68.72) ; 66.3,70.31 65.03,70.31 65.03,70.35 C10.2 ; U18.3 64.97,70.31 ; C51.2 v1(9.54,24.76)
VBAT_OUT: length 2.5
  Bottom Layer w0.381: Q7.3 67.44,76.52 67.88,76.08 69.01,76.08
AUDIO_SD: length 14.5
  Bottom Layer w0.152: v1(7.76,88.87) 18.79,88.87 19.63,89.71 20.25,89.71
  Bottom Layer w0.203: U15.4 7.75,88.85 v1(7.76,88.87) 7.76,89.19 R42.1
BACKLIGHT: length 16.9
  Bottom Layer w0.152: R1.2 18.08,68.38 18.08,75.91 18.4,76.24 18.4,79.43 19.79,80.82 20.25,80.82
  Bottom Layer w0.229: Q1.1 16.64,67.18 R1.2
BAT_ADC: length 7.5
  Bottom Layer w0.203: U14.17 33.64,68.86 33.56,68.77 35.13,68.77 R50.2
  Bottom Layer w0.254: R51.1 36.64,68.77 R50.2
CLK_OUT: length 5.2
  Bottom Layer w0.203: U25.7 5.6,25.94 6.32,26.66 9.14,26.66 NOREF#2.1
COL1: length 29.2
  Bottom Layer w0.152: 8.24,60.9 9.06,60.9 9.64,60.32 9.64,57.81 10.1,57.34 10.89,57.34 11.6,56.63 12.64,56.63 24.76,68.75 U14.24
COL2: length 30
  Bottom Layer w0.152: 8.24,60.5 8.85,60.5 9.33,60.02 9.33,57.68 10.03,56.99 10.76,56.99 11.42,56.33 12.76,56.33 26.03,69.59 U14.23
COL3: length 31.2
  Bottom Layer w0.152: 8.24,60.1 8.64,60.1 9.03,59.71 9.03,57.56 9.57,57.02 9.57,56.25 9.8,56.02 12.88,56.02 27.3,70.44 U14.22
COL4: length 32.1
  Bottom Layer w0.152: 8.24,59.7 8.56,59.7 8.73,59.53 8.73,57.43 9.24,56.92 9.24,56.07 9.62,55.69 12.98,55.69 28.57,71.28 U14.21
COL5: length 38.6
  Bottom Layer w0.152: U14.18 32.3,73.11 32.3,72.1 31.87,71.67 30.24,71.67 13.3,54.73 7.99,54.73 6.98,55.74 6.98,58.79 7.49,59.3 8.24,59.3
COL6: length 35.8
  Bottom Layer w0.152: U14.19 31.11,72.43 30.65,71.97 30.12,71.97 13.2,55.06 8.25,55.06 7.28,56.03 7.28,58.53 7.64,58.9 8.24,58.9
COL7: length 33.4
  Bottom Layer w0.152: U14.20 29.83,72.12 13.1,55.39 8.43,55.39 7.58,56.23 7.58,58.26 7.83,58.5 8.24,58.5
EN: length 129.1
  Top Layer w0.152: v1(14.44,69.69) 14.83,69.3 14.83,57.63 7.84,50.64 7.84,43.78 v1(7.64,43.58) ; v1(40.15,87.27) 52.09,87.27 54.55,84.8 v1(54.58,84.8) 54.58,71.36 53.9,70.69 U19.2
  Top Layer w0.254: v1(3.62,84.45) 4.69,84.45 5.38,85.13 v1(15.47,85.13) v1(25.01,85.13)
  Bottom Layer w0.152: v1(54.58,84.8) 56.18,84.8 58.29,86.92 U16.4 ; Q6.3 15.27,69.69 v1(14.44,69.69) 14.01,70.12 14.01,78.36 14.32,78.66 14.32,80.86 15.46,82.01 15.46,85.13 ; 10.89,43.58 v1(7.64,43.58)
  Bottom Layer w0.229: Q6.3 16.71,69.64 R19.1
  Bottom Layer w0.305: v1(3.62,84.45) 3.62,85.28 3.66,85.31 ; v1(25.01,85.13) 25.44,85.13 28.74,88.43 39.73,88.43 R33.1
  Bottom Layer w0.381: C33.1 40.13,86.51 R33.1
I2S_BCK: length 17.1
  Top Layer w0.203: v1(4.77,87.52) 5.73,86.55 18.69,86.55 v1(18.89,86.76)
  Bottom Layer w0.203: U15.16 4.91,87.38 v1(4.77,87.52)
  Bottom Layer w0.254: v1(18.89,86.76) 19.3,87.17 U14.37
I2S_DATA: length 40.9
  Top Layer w0.203: v1(29.2,76.98) 28.64,76.98 26.31,79.31 26.31,84.93 25.32,85.92 21.29,85.92 19.89,87.32 6.27,87.32 5.63,87.95 v1(5.63,88.03)
  Bottom Layer w0.203: v1(29.2,76.98) 29.25,77.03 37.93,77.03 U14.12 ; v1(5.63,88.03) 5.73,88.13 U15.1
I2S_WS: length 16.8
  Top Layer w0.203: v1(4.69,86.33) 5.1,85.92 v1(18.97,85.92)
  Bottom Layer w0.203: U15.14 4.74,86.38 v1(4.69,86.33)
  Bottom Layer w0.254: v1(18.97,85.92) 18.99,85.9 U14.36
IO0: length 44
  Top Layer w0.203: v1(2.84,78.43) 19.09,78.43 21.51,76.01 v1(21.51,74.54)
  Bottom Layer w0.152: 10.42,60.5 15.22,60.5 19.63,64.91 19.63,73.64 U14.27 21.43,74.47 v1(21.51,74.54)
  Bottom Layer w0.254: v1(2.84,78.43) 3.63,78.43
IO2: length 81.8
  Top Layer w0.152: v1(15.13,73.85) 15.13,57.13 8.2,50.19 8.2,29.71 9.54,28.36 v1(9.54,28.29)
  Bottom Layer w0.152: v1(15.13,73.85) 14.34,74.64 14.34,78.2 15.35,79.2 Q3.3 ; v1(11.02,53.03) 8.12,53.03 7.21,52.11 U26.13 ; 20.25,88.44 19.1,88.44 17.72,87.05 17.72,80.46 17.09,79.82 16.69,79.82 ; 10.89,28.34 10.84,28.29 v1(9.54,28.29) 6.37,28.29 4.95,26.87 U25.6
  Bottom Layer w0.229: R13.1 16.69,79.82 v1(16.1,79.82) Q3.3
IO3: length 30.4
  Top Layer w0.152: U19.5 49.26,73.09 43.93,67.76 v1(40.23,67.76)
  Bottom Layer w0.152: FPC1.3 38.25,61.54 39.06,62.35 39.8,62.35 40.23,62.77 v1(40.23,67.76)
  Bottom Layer w0.203: v1(40.23,67.76) 36.19,71.8 U14.15
IO4: length 32.6
  Top Layer w0.152: v1(39.11,87.14) 39.11,72.36 31.59,64.84 v1(26.36,64.84)
  Bottom Layer w0.152: v1(39.11,87.14) 39.08,87.17 U14.4
  Bottom Layer w0.254: v1(26.36,64.84) 26.38,64.81 R45.1
IO5: length 11.3
  Bottom Layer w0.152: U16.15 42.97,90.92 42.41,90.36 42.41,85.69 41.95,85.23 39.49,85.23 38.82,85.9 U14.5
IO6: length 62.9
  Top Layer w0.152: v1(36.85,84.62) 38.81,82.67 38.81,72.48 31.67,65.34 25.57,65.34 9.19,48.96 9.19,41.24 v1(9.39,41.04)
  Bottom Layer w0.152: U14.6 37.95,84.62 v1(36.85,84.62) ; 10.89,41.04 v1(9.39,41.04)
IO7: length 28.8
  Bottom Layer w0.152: U16.5 57.03,84.92 56.23,84.12 52.01,84.12 45.31,77.41 42.46,77.41 39.97,79.9 39.97,82.44 39.05,83.36 U14.7
IO16: length 39.1
  Top Layer w0.152: v1(40.94,70.55) 41.57,71.19 41.57,73.22 41.22,73.57 v1(41.22,76.44)
  Bottom Layer w0.152: v1(40.94,70.55) 42.46,69.03 45.1,69.03 51.94,62.2 51.94,57.42 53.36,56 55.33,56 R28.1 57.31,56.4 CARD1.2 ; U14.9 38.62,80.82 39.23,80.21 39.23,79.57 41.22,77.59 v1(41.22,76.44)
IO19: length 39
  Bottom Layer w0.152: 65.49,86 65.54,86 65.87,85.67 USBC1.A7 ; 65.49,86 66.16,86.67 USBC1.B7 ; 65.49,86 62.58,83.09 62.58,79.04 61.49,77.94 47.72,77.94 45.03,75.26 39.74,75.26 39.26,75.74 U14.13
IO20: length 39.1
  Bottom Layer w0.152: USBC1.A6 68.27,86.17 68.54,85.9 68.54,85.47 68.24,85.17 USBC1.B6 67.51,85.15 67.5,85.13 65.05,85.13 62.88,82.96 62.88,78.91 61.61,77.64 47.85,77.64 45.16,74.95 39.74,74.95 39.26,74.47 U14.14
IO35: length 22.1
  Bottom Layer w0.152: 10.42,60.9 15.19,60.9 19.29,65 19.29,75.14 19.89,75.74 U14.28
IO36: length 23.1
  Bottom Layer w0.152: U14.29 19.61,77.01 19.31,76.71 19.31,75.86 18.99,75.54 18.99,74.92 18.99,74.92 18.99,65.12 15.17,61.3 10.42,61.3
IO37: length 23.9
  Bottom Layer w0.152: 10.42,61.7 15.14,61.7 18.69,65.25 18.69,74.79 18.68,74.8 18.68,75.66 19.01,75.99 19.01,77.86 19.45,78.3 20.23,78.3 20.25,78.28
IO38: length 24.9
  Bottom Layer w0.152: 10.42,62.1 15.11,62.1 18.38,65.37 18.38,75.79 18.71,76.11 18.71,79.13 19.12,79.55 20.25,79.55
IO40: length 51.2
  Top Layer w0.152: v1(9.19,38.5) 8.84,38.85 8.84,49.24 15.73,56.14 15.73,67.4 v1(16.68,68.34)
  Bottom Layer w0.152: v1(16.68,68.34) 17.16,68.34 17.74,68.92 17.74,76.07 18.09,76.41 18.08,79.53 18.69,80.14 18.69,81.4 19.38,82.09 U14.33 ; 10.89,38.5 v1(9.19,38.5)
IO41: length 75
  Top Layer w0.152: v1(9.57,30.85) 9.35,30.85 8.53,31.67 8.53,49.72 15.43,56.62 15.43,72.31 v1(16.1,72.97)
  Bottom Layer w0.152: 10.89,30.88 10.86,30.85 v1(9.57,30.85) 8.07,30.85 4.3,27.08 U25.5 ; 20.25,83.36 18.84,83.36 18.35,82.87 18.35,80.24 17.77,79.65 17.78,76.53 17.44,76.19 17.44,73.32 17.07,72.95 16.76,72.95 ; v1(11.19,52.39) 8.07,52.39 7.71,52.03 U26.14
  Bottom Layer w0.229: 16.76,72.95 16.71,72.99 Q4.3
IO42: length 12.1
  Bottom Layer w0.152: 20.25,84.63 18.89,84.63 18.05,83.78 18.05,80.36 17.47,79.78 17.47,76.72 17.15,76.4 R17.1
  Bottom Layer w0.229: Q5.3 16.72,76.39 R17.1
IO45: length 20.8
  Bottom Layer w0.152: U14.26 22.22,67.07 15.25,60.1 10.42,60.1
IO46: length 31.2
  Top Layer w0.152: U19.4 48.97,72.29 43.86,67.17 v1(37.99,67.17)
  Bottom Layer w0.254: FPC1.5 37.25,62.58 C16.1 38,69.17 34.92,72.26 U14.16
IO48: length 21.7
  Bottom Layer w0.152: 10.42,59.7 15.28,59.7 23.48,67.91 U14.25
LCD_+5V: length 4.8
  Bottom Layer w0.508: J2.1 42.89,65.43 42.89,64.46 43.48,63.86 C37.2 44.84,63.86 U20.1
LCD_VDD: length 16.1
  Top Layer w0.381: v1(37.08,65.6) 44.34,65.6 v1(44.77,66.03)
  Bottom Layer w0.254: 36.25,61.81 36.75,61.31 FPC1.6 ; 36.25,61.81 36.25,64.95 C18.1 ; 36.25,61.81 FPC1.7
  Bottom Layer w0.381: v1(44.77,66.03) 44.77,65.5 44.8,65.47 ; C18.1 36.9,65.6 v1(37.08,65.6)
LEDK1: length 54.1
  Top Layer w0.305: 28.03,58.54 33.14,58.54 34.21,59.6 34.21,64.33 38.24,68.37 43.96,68.37 47.31,71.72 47.31,77.11 48.1,77.89 52.5,77.89
  Bottom Layer w0.254: FPC2.3 22.8,61.24 22.87,61.31 ; 23.32,61.31 22.87,61.31 ; 23.32,61.31 23.82,61.31 ; 23.32,61.31 23.3,61.28 FPC2.2 ; 22.87,61.31 22.47,61.31 22.3,61.14 FPC2.4 ; 23.82,61.31 23.8,61.29 FPC2.1 ; 23.82,61.31 P2.1 ; P2.1 26.17,61.28 ; P2.1 27.94,61.31
  Bottom Layer w0.305: v1(28.03,58.51) R46.2
LEDK2: length 39.2
  Top Layer w0.305: 29.51,59.22 32.94,59.22 33.65,59.93 33.65,64.63 37.91,68.9 43.73,68.9 46.7,71.87 46.7,77.38 48.01,78.69 U19.12
  Bottom Layer w0.305: v1(29.48,59.22) 29.48,61.34 R47.2
LEDK3: length 37.2
  Top Layer w0.305: U19.13 47.99,79.49 46.07,77.56 46.07,72 43.5,69.43 37.64,69.43 33.09,64.89 33.09,60.27 32.66,59.83 30.98,59.83
  Bottom Layer w0.305: v1(31.01,59.83) 31.01,61.34 R48.2
LEDK4: length 34.9
  Top Layer w0.305: v1(32.45,60.54) 32.45,65.01 37.36,69.92 43.2,69.92 45.53,72.25 45.53,77.84 47.98,80.29 U19.14
  Bottom Layer w0.305: R49.2 v1(32.45,60.54)
LORA_ANT: length 8.3
  Bottom Layer w0.5: RF1.5 64.91,93.49 64.35,92.92 U16.1
LORA_MISO: length 58.9
  Top Layer w0.152: v1(46.19,85.94) 46.19,84.62 45.61,84.04 43.68,84.04 41.88,82.24 v1(41.88,76.44) 41.88,73.55 v1(42.23,73.19) ; v1(48.33,73.22) 49.8,74.69 U19.7
  Bottom Layer w0.152: U16.13 45.22,86.92 v1(46.19,85.94) ; v1(48.33,73.22) 48.18,73.37 42.41,73.37 v1(42.23,73.19) 42.23,71.29 43.35,70.17 45.31,70.17 52.82,62.65 55.39,62.65 R31.1 58,61.92 CARD1.7 ; U14.8 38.79,82.09 39.67,81.21 39.67,79.73 41.88,77.52 v1(41.88,76.44)
LORA_MOSI: length 82.8
  Top Layer w0.152: v1(50.92,73.93) 50.96,73.89 52.5,73.89 ; v1(41.01,72.97) 40.99,72.99 v1(39.87,72.99) 39.84,73.02 v1(39.84,76.47) 39.84,76.69 41.04,77.88 41.04,82.72 44.9,86.58 v1(46.8,86.58)
  Bottom Layer w0.152: 40.05,72.99 39.85,72.79 39.85,69.48 41.55,67.79 41.55,62.96 40.63,62.04 39.31,62.04 38.75,61.48 FPC1.2 ; 40.05,72.99 v1(39.87,72.99) ; 40.05,72.99 39.9,73.14 39.9,73.76 40.17,74.03 50.82,74.03 v1(50.92,73.93) ; CARD1.3 57.5,57.5 56.71,56.71 R29.1 56.12,57.12 55.67,57.57 53.82,57.57 52.32,59.08 52.32,62.24 45.2,69.36 42.89,69.36 41.01,71.24 v1(41.01,72.97) ; v1(39.84,76.47) 39.84,77.66 39.23,78.28 U14.11 ; v1(46.8,86.58) 46.8,87.34 45.23,88.92 U16.14
LORA_SCK: length 73.3
  Top Layer w0.152: v1(50.89,71.49) 50.9,71.49 U19.3 ; v1(40.43,73.5) 40.43,76.32 v1(40.56,76.44) 40.56,76.66 41.45,77.55 41.45,82.46 43.88,84.9 v1(45.41,84.9)
  Bottom Layer w0.152: v1(45.41,84.9) 45.39,84.92 U16.12 ; 41.34,73.5 41.57,73.73 48.66,73.73 v1(50.89,71.49) ; 41.34,73.5 41.62,73.22 41.62,71.19 43.01,69.8 45.19,69.8 52.67,62.31 52.67,61.76 53.26,61.18 55.39,61.18 R30.1 56.74,60.44 57.48,59.7 CARD1.5 ; 41.34,73.5 v1(40.43,73.5) 40.43,69.43 42.08,67.78 42.08,62.98 40.78,61.69 39.67,61.69 39.25,61.27 FPC1.1 ; v1(40.56,76.44) 40.56,77.74 38.74,79.55 U14.10
MIC: length 1.9
  Bottom Layer w0.152: 12.13,58.11 11.85,58.11 11.46,58.5 10.42,58.5
RTC_INT: length 4.4
  Bottom Layer w0.203: 2.16,22.57 2.21,22.52 4.23,22.52 4.95,21.81 U25.3
SD_DETECT: length 2.2
  Bottom Layer w0.152: CARD1.9 57.21,64.1 56.45,64.86 R32.1
STATE_CHARGE: length 2.5
  Bottom Layer w0.203: U18.1 63.78,72.21 64.92,73.35 R39.1
TP_MOTION_1V8: length 16.1
  Bottom Layer w0.152: R16.1 10,75.75 10,70.62 9.34,69.96 9.34,65.9 9.14,65.7 9.14,64.64 8.6,64.1 8.24,64.1
  Bottom Layer w0.229: R16.1 11.59,77.34 Q5.2
TP_RESET_1V8: length 11.4
  Bottom Layer w0.152: 8.24,63.3 8.74,63.3 9.75,64.31 9.75,65.41 10.17,65.83 10.56,65.83 11.02,66.28 11.02,67.28 10.37,67.92 10.37,70.14 10.63,70.39 R18.1
  Bottom Layer w0.229: R18.1 11.64,70.59 Q6.2
TP_SCL_1V8: length 19.1
  Bottom Layer w0.152: R12.1 10.38,79.59 10.38,76.56 9.7,75.88 9.7,70.74 9.04,70.09 9.04,66.03 8.84,65.82 8.84,64.81 8.53,64.5 8.24,64.5
  Bottom Layer w0.229: Q3.2 11.57,80.77 R12.1
TP_SDA_1V8: length 13.2
  Bottom Layer w0.152: 11.45,73.72 11.24,73.72 10.33,72.81 10.33,70.52 9.64,69.84 9.64,65.78 9.44,65.57 9.44,64.51 8.63,63.7 8.24,63.7
  Bottom Layer w0.229: Q4.2 11.67,73.94 11.45,73.72
TP_SHUTDOWN_1V8: length 22.7
  Bottom Layer w0.152: 8.24,64.9 7.83,64.9 7.66,65.06 7.66,69.21 9.4,70.94 9.4,76 10.08,76.68 10.08,80.77 11.56,82.24 R53.2 14.17,83.74 R10.1
VON: length 4.2
  Bottom Layer w0.508: NOREF.1 5.29,80.12 C48.1 L3.2
VOP: length 4.5
  Bottom Layer w0.508: L4.2 9.73,83.81 C47.2 9.73,81.58 8.81,80.65 NOREF#5.2
VSYS: length 44.6
  Top Layer w0.381: v1(55.21,77.05) 55.26,77 55.26,70.09 53.92,68.75 46.17,68.75 43.96,66.54 v1(37.33,66.54)
  Bottom Layer w0.254: U6.3 57.17,74.37 57.17,73.45 56.84,73.12 55.57,73.12 55.25,73.43 U6.1
  Bottom Layer w0.305: v1(55.21,77.05) 55.15,76.99 C2.1 55.25,75.94 U6.1
  Bottom Layer w0.381: 65.14,78.26 64.39,77.52 D4.1 63.39,77.21 55.36,77.21 v1(55.21,77.05) ; R51.2 36.64,67.22 v1(37.33,66.54)
$1N3932: length 3.3
  Bottom Layer w0.203: R6.1 65.55,83.68 66.03,84.17 USBC1.B5
$1N3938: length 3.3
  Bottom Layer w0.152: USBC1.A5 67.06,87.17
  Bottom Layer w0.254: R3.1 65.24,88.45 66.53,87.17 67.06,87.17
$2N4033: length 2.9
  Bottom Layer w0.254: Q10.1 30,66.34 R44.2 R45.2
$2N4464: length 5.9
  Bottom Layer w0.254: R48.1 R49.1 ; R48.1 R47.1 R46.1 ; R48.1 30.98,64.32 Q10.3
$3N1671: length 2.4
  Bottom Layer w0.152: R35.1 56.66,63.39 57.04,63 58.37,63
$3N1675: length 2.3
  Bottom Layer w0.152: CARD1.1 58.07,55.3 56.48,53.71
$4N13436: length 1.5
  Bottom Layer w0.254: U18.5 60.77,72.26 R41.2
$4N13446: length 8.5
  Top Layer w0.203: v1(70.86,78.43) 67.33,74.89 v1(66.13,74.89)
  Bottom Layer w0.203: R39.2 65.38,74.89 v1(66.13,74.89)
  Bottom Layer w0.254: LED5.2 71.4,78.97 v1(70.86,78.43)
$5N525: length 1.5
  Bottom Layer w0.203: R43.1 6.75,89.56 U15.2
$5N2893: length 1.5
  Bottom Layer w0.254: L3.1 7.25,84.4 U15.10
$5N2899: length 1.5
  Bottom Layer w0.254: U15.9 7.75,84.39 8.28,83.86
$8N1366: length 1.8
  Bottom Layer w0.152: 11.53,58.9 11.87,58.9 12.1,59.12 ; 11.53,58.9 10.42,58.9 ; 11.53,58.9 11.54,58.89
$8N1374: length 7.2
  Bottom Layer w0.229: 10.42,62.5 9.92,62.5 9.67,62.75 9.67,63.38 9.85,63.55 ; Q1.3 12.88,65.43 11.55,64.1 U1.37 10.1,64.1 9.85,63.85 9.85,63.55 ; 10.42,63.3 10.1,63.3 9.85,63.55
$11N541: length 5.3
  Bottom Layer w0.254: C50.1 7.08,15.54 7.08,17.54 6.25,18.37 U25.1
$11N548: length 5.4
  Bottom Layer w0.254: U25.2 5.6,18.6 X3.1 4.53,15.54 C49.2
$12N227: length 2.7
  Bottom Layer w0.152: 4.51,51.92 6.38,51.92 6.71,51.6 U26.12
$12N283: length 3.1
  Bottom Layer w0.203: U26.1 9.79,50.98 R55.1 10.06,49.36 J4.1

## Copper pours and planes (outline as drawn; the poured copper is in the pictures)
3.3V on Bottom Layer: 45.48,59.66 46.81,59.66 46.81,57.29 45.48,57.29
3.3V on PWR: -10.27,102.43 88.77,102.43 88.77,-10.12 -10.27,-10.12
GND on Top Layer: -7.75,99.66 77.67,99.66 77.67,-17.26 -7.75,-17.26
GND on Bottom Layer: 59.19,72.08 60.47,72.08 60.47,70.96 59.19,70.96
GND on Bottom Layer: -12.86,104.92 85.64,104.92 85.64,-11.01 -12.86,-11.01
GND on Bottom Layer: 60.25,72.2 65.55,72.2 65.55,70.96 60.25,70.96
GND on GND: -11.97,100.17 82.77,100.17 82.77,-1.36 -11.97,-1.36
$2N4931 on Bottom Layer: 46.49,60.06 48.25,60.06 48.25,55.31 46.49,55.31
$2N4934 on Bottom Layer: 43.28,60.07 45.13,60.07 45.13,55.33 43.28,55.33

Small or netless copper shapes (teardrops, artwork), in the pictures only: 71 on Top Layer, 458 on Bottom Layer

## Text on the board
Bottom Solder Mask Layer: MagicBerry
Bottom Silkscreen Layer: + | - | x | JLCJLCJLCJLC | BATT | SPEAKER | io2 | io6 | RST | io41 | GND | 3.3v | SCL | SDA | rtc_int | clk_out | io40 | 5v | 3v | 3V: LPM027 | 5V: LS027B
Top Solder Mask Layer: 20230630   Rev2.1
Top Silkscreen Layer: https://oshwhub.com/kakaka | RST | BOOT
